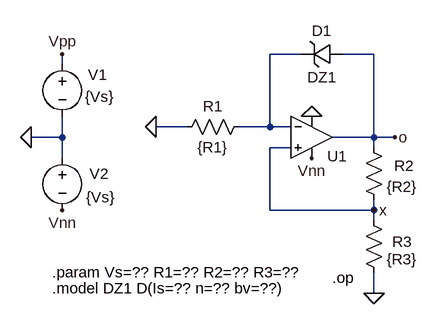
[diagram p0: schematic COMB10opFig.asc]
COMB10opFig.asc, the LTspice schematic file:
Version 4
SHEET 1 2180 1076
WIRE 736 -320 688 -320
WIRE 848 -320 800 -320
WIRE 368 -304 368 -320
WIRE 560 -208 512 -208
WIRE 688 -208 688 -320
WIRE 688 -208 640 -208
WIRE 720 -208 688 -208
WIRE 368 -192 368 -224
WIRE 368 -192 320 -192
WIRE 848 -192 848 -320
WIRE 848 -192 784 -192
WIRE 880 -192 848 -192
WIRE 720 -176 688 -176
WIRE 848 -176 848 -192
WIRE 368 -160 368 -192
WIRE 688 -80 688 -176
WIRE 848 -80 848 -96
WIRE 848 -80 688 -80
WIRE 848 -64 848 -80
WIRE 848 48 848 16
FLAG 368 -320 Vpp
FLAG 320 -192 0
FLAG 368 -80 Vnn
FLAG 848 48 0
FLAG 512 -208 0
FLAG 880 -192 o
FLAG 848 -80 x
FLAG 752 -224 0
FLAG 752 -160 Vnn
SYMBOL voltage 368 -320 R0
WINDOW 123 0 0 Left 0
WINDOW 39 0 0 Left 0
WINDOW 0 40 32 Left 2
WINDOW 3 35 66 Left 2
SYMATTR InstName V1
SYMATTR Value {Vs}
SYMBOL voltage 368 -176 R0
WINDOW 123 0 0 Left 0
WINDOW 39 0 0 Left 0
WINDOW 0 42 40 Left 2
WINDOW 3 37 76 Left 2
SYMATTR InstName V2
SYMATTR Value {Vs}
SYMBOL res 832 -192 R0
WINDOW 0 47 44 Left 2
SYMATTR InstName R2
SYMATTR Value {R2}
SYMBOL res 544 -192 R270
WINDOW 0 32 56 VTop 2
WINDOW 3 0 56 VBottom 2
SYMATTR InstName R1
SYMATTR Value {R1}
SYMBOL res 832 -80 R0
WINDOW 0 44 49 Left 2
SYMATTR InstName R3
SYMATTR Value {R3}
SYMBOL zener 800 -336 R90
WINDOW 0 -4 32 VBottom 2
WINDOW 3 36 32 VTop 2
SYMATTR InstName D1
SYMATTR Value DZ1
SYMBOL OpAmps\\UniversalOpAmp2 752 -192 R0
WINDOW 0 24 29 Left 2
SYMATTR InstName U1
TEXT 784 24 Left 2 !.op
TEXT 352 16 Left 2 !.param Vs=?? R1=?? R2=?? R3=??
TEXT 352 40 Left 2 !.model DZ1 D(Is=?? n=?? bv=??)

The netlist it stands for:
* COMB10opFig.asc
V1 Vpp 0 {Vs}
V2 0 Vnn {Vs}
R2 o x {R2}
R1 0 N001 {R1}
R3 x 0 {R3}
D1 o N001 DZ1
XU1 x N001 0 Vnn o level2 Avol=1Meg GBW=10Meg Slew=10Meg Ilimit=25m Rail=0 Vos=0 En=0 Enk=0 In=0 Ink=0 Rin=500Meg  ; pins In+ In- V+ V- OUT
.model D D
.lib standard.dio
.op
.param Vs=?? R1=?? R2=?? R3=??
.model DZ1 D(Is=?? n=?? bv=??)
.lib UniversalOpAmp2.lib
.backanno
.end